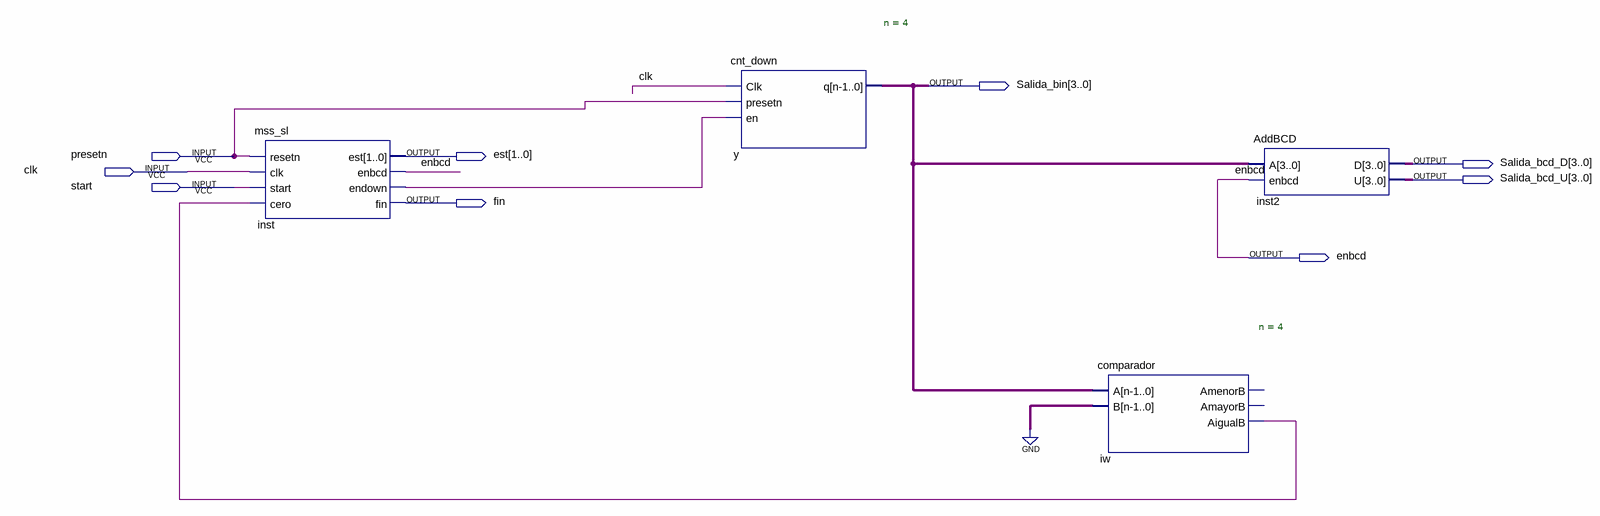
[diagram p0: schematic sheet]
// Quartus schematic modelo.bdf as structural Verilog: 4 symbols, 9 pins
module modelo (
  input  presetn,
  input  clk,
  input  start,
  output [3:0] Salida_bin,
  output [1:0] est,
  output [3:0] Salida_bcd_D,
  output [3:0] Salida_bcd_U,
  output fin,
  output enbcd
);

  wire inst_endown, iw_aigualb;

  mss_sl inst (
    .resetn(presetn), .clk(clk), .start(start), .cero(iw_aigualb), .est(est), .enbcd(enbcd),
    .endown(inst_endown), .fin(fin));
  cnt_down #(.n(4)) y (.Clk(clk), .presetn(presetn), .en(inst_endown), .q(Salida_bin));
  comparador #(.n(4)) iw (.A(Salida_bin), .B(4'b0000), .AigualB(iw_aigualb));  // open: AmenorB, AmayorB
  AddBCD inst2 (.A(Salida_bin), .enbcd(enbcd), .D(Salida_bcd_D), .U(Salida_bcd_U));
endmodule
